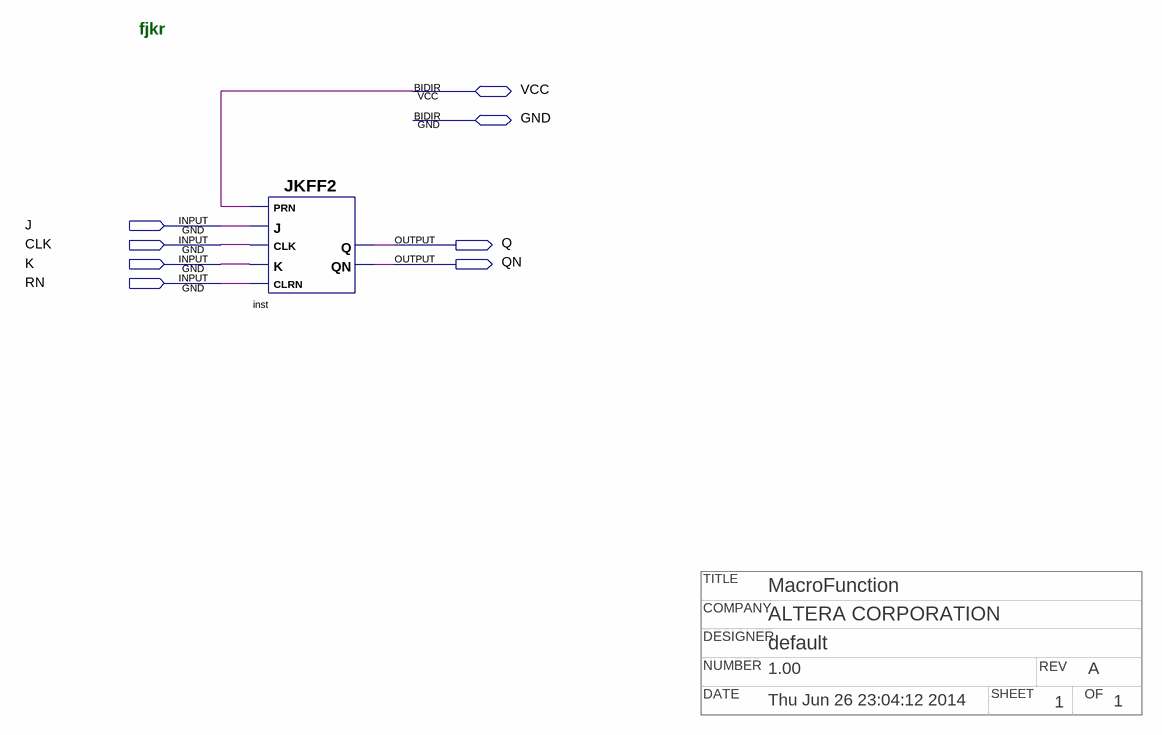
[diagram p0: schematic sheet]
// Quartus schematic npfjkr.bdf as structural Verilog: 1 symbols, 8 pins
// Title block: TITLE: MacroFunction; COMPANY: ALTERA CORPORATION; DESIGNER: default; NUMBER: 1.00; REV: A; DATE: Thu Jun 26 23:04:12 2014; SHEET: 1; OF: 1
module npfjkr (
  input  J,
  input  CLK,
  input  K,
  input  RN,
  inout  VCC,
  inout  GND,
  output Q,
  output QN
);

  JKFF2 inst (.K(K), .CLRN(RN), .CLK(CLK), .PRN(VCC), .J(J), .QN(QN), .Q(Q));

  // Notes on the sheet:
  //   fjkr
endmodule
